# EasyEDA Pro project PCBA_碳化硅3KW图腾柱PFC_2025-04-21.epro, schematic Schematic1_1, sheets 1 to 3 of 6

## Sheets
1 主功率: Board Name: Board1_1; Create Date: 2025-03-01; Page Name: 主功率; Project Name: 碳化硅3KW图腾柱PFC; Schematic Name: Schematic1_1; Update Date: 2025-04-20; Company: 嘉立创EDA; Page Size: A4; Version: V1.0
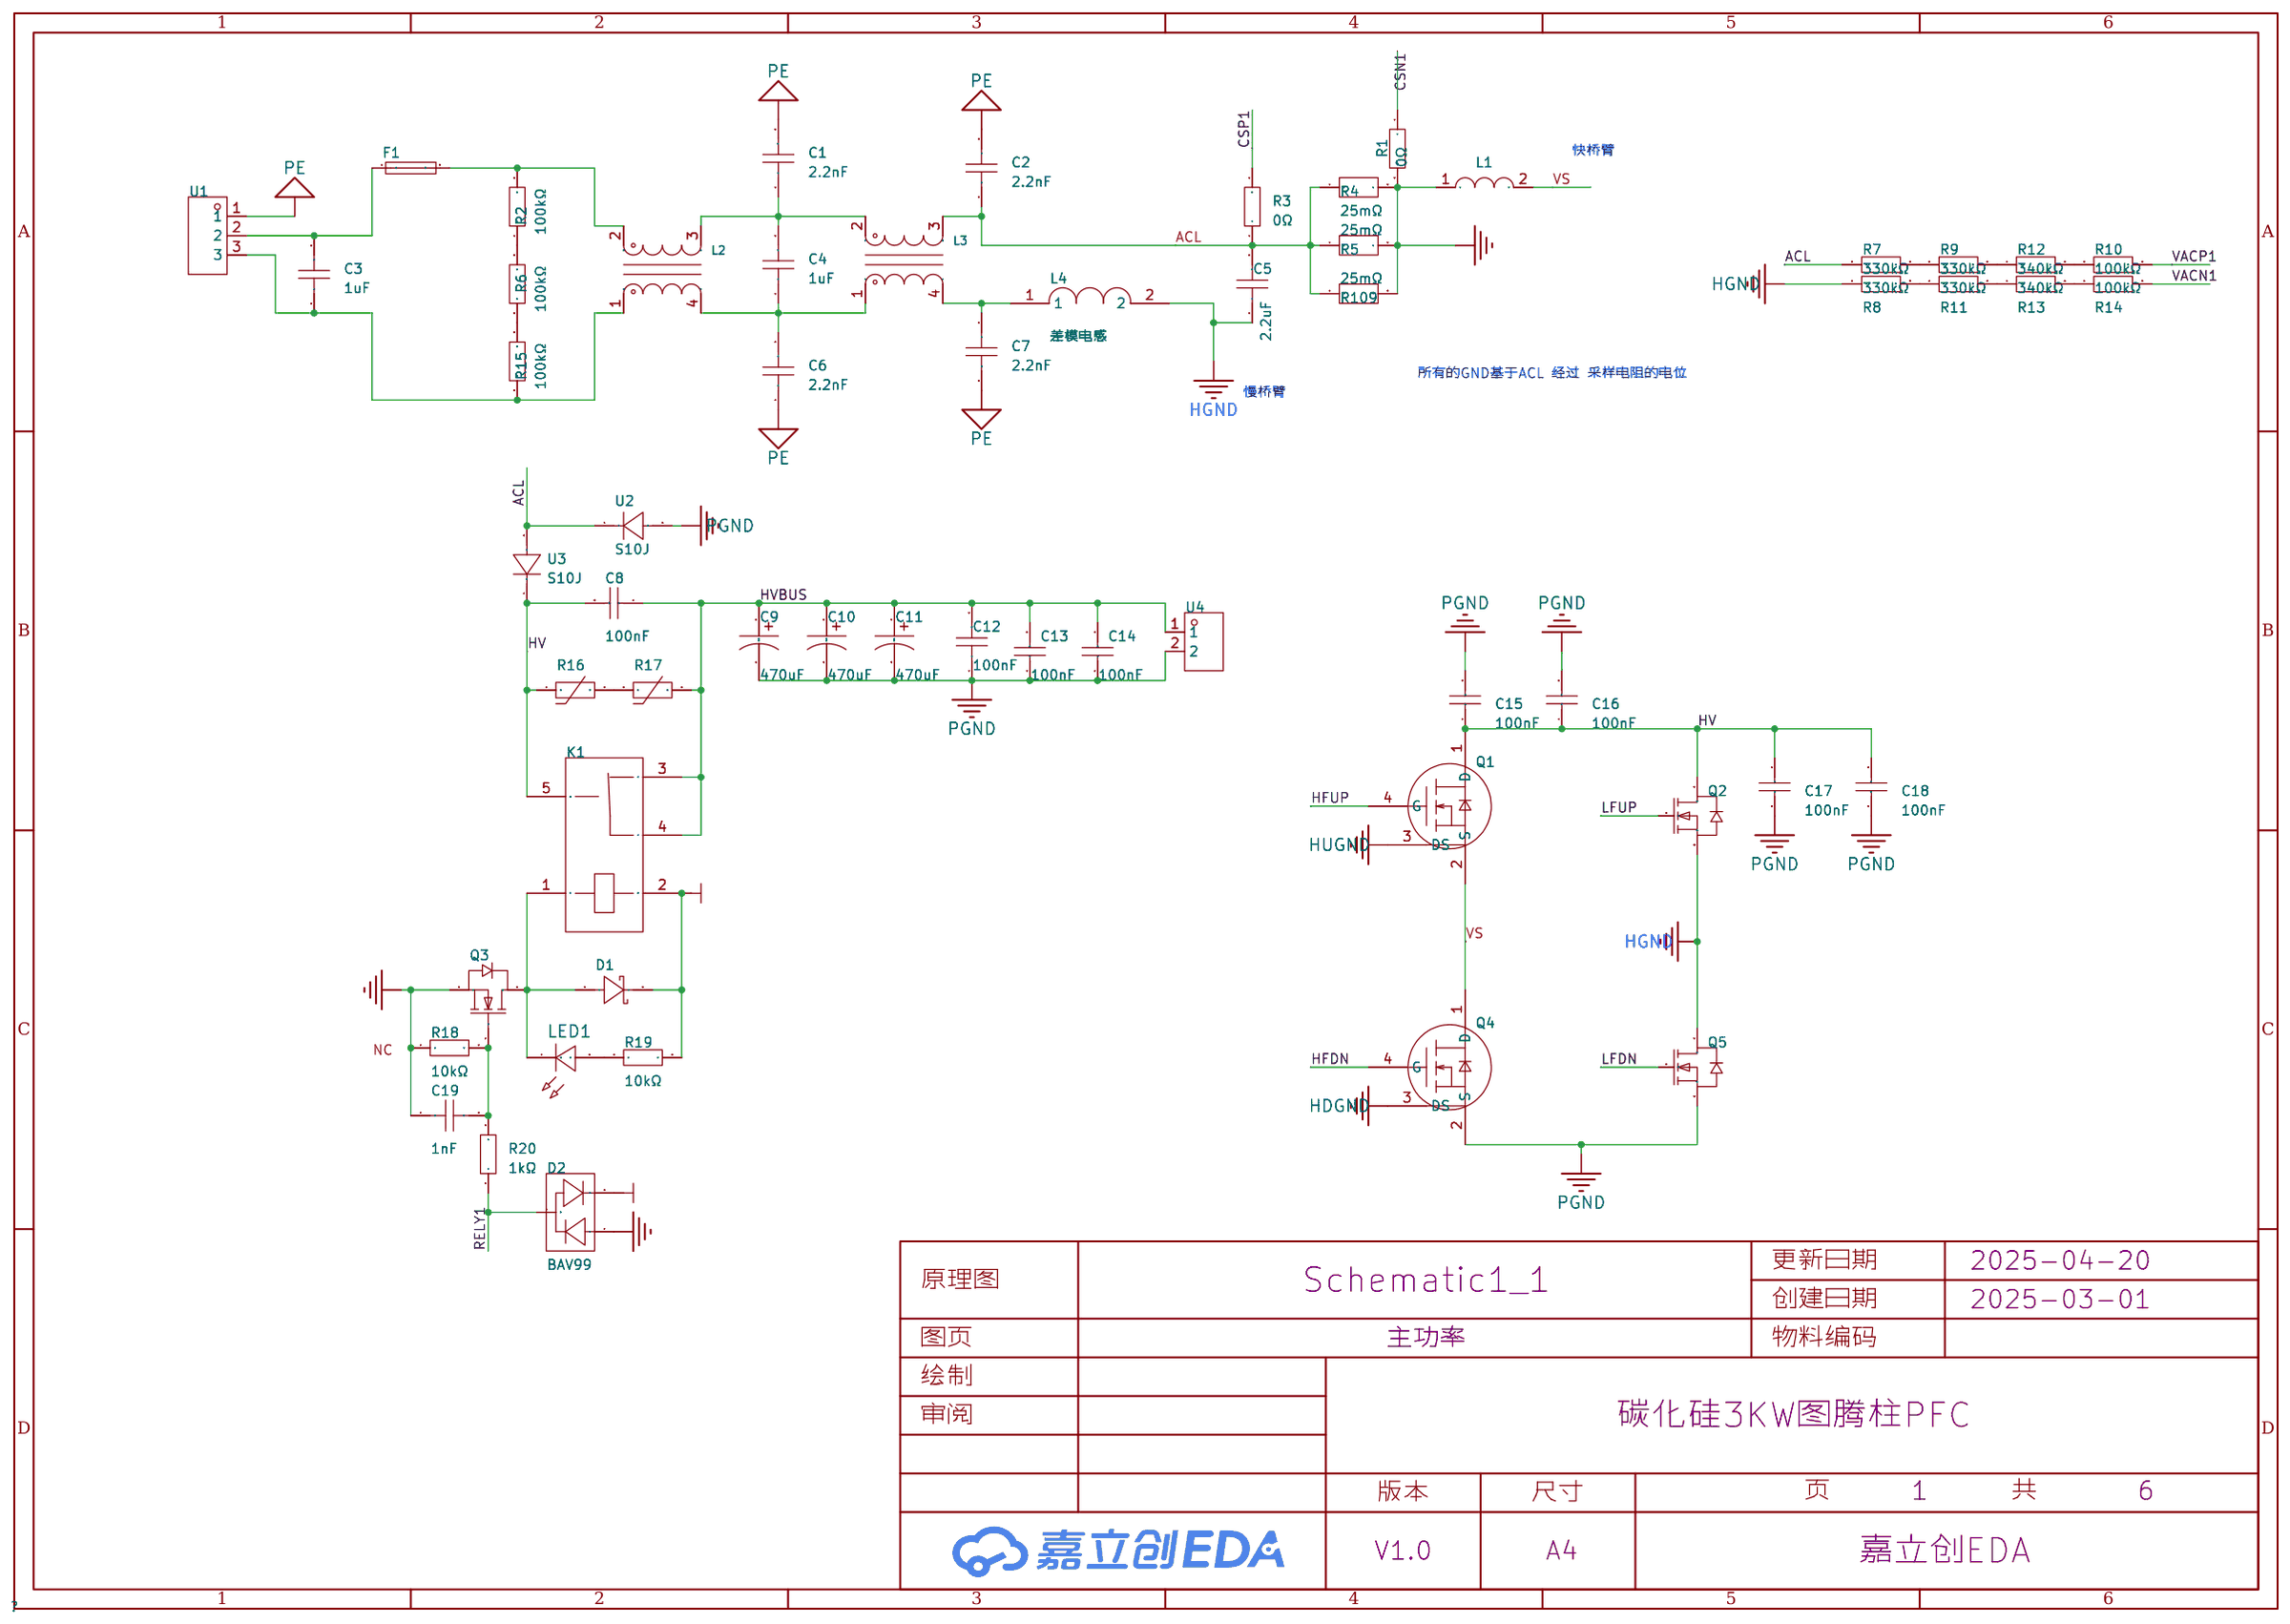
[diagram p0: 主功率]
2 主控: Page Name: 主控; Update Date: 2025-03-01
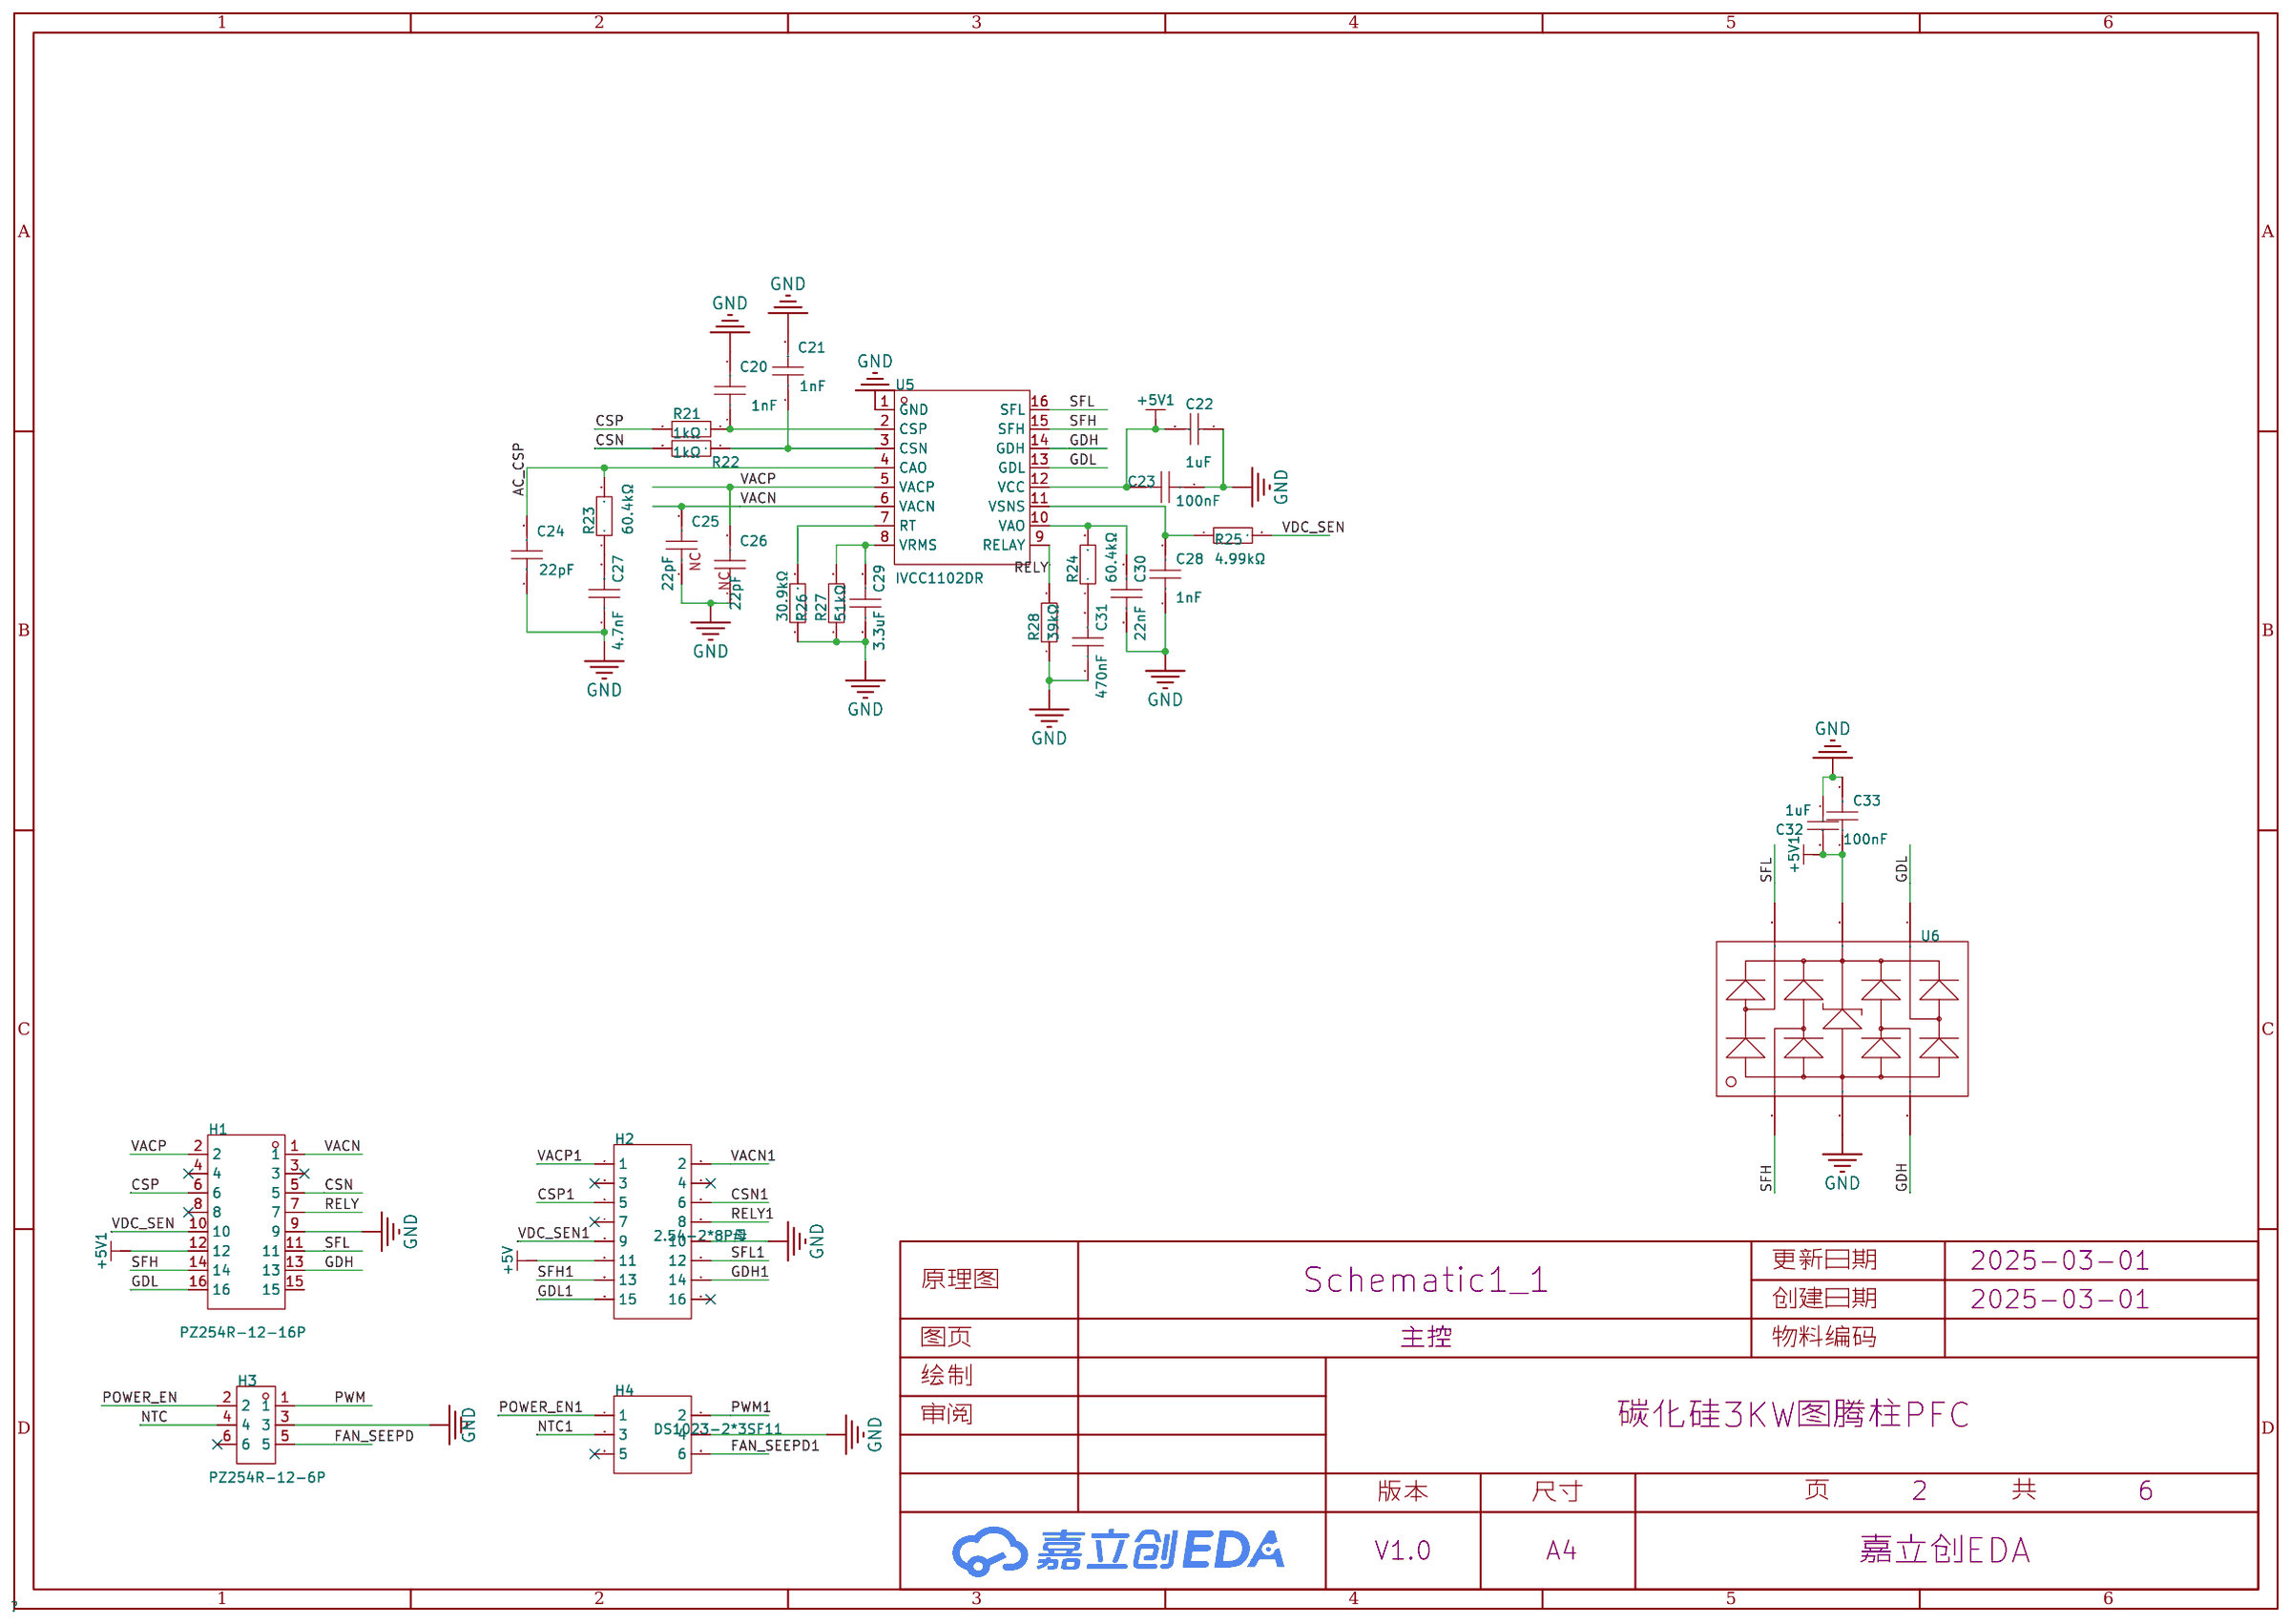
[diagram p1: 主控]
3 辅助供电: Page Name: 辅助供电; Update Date: 2025-03-19
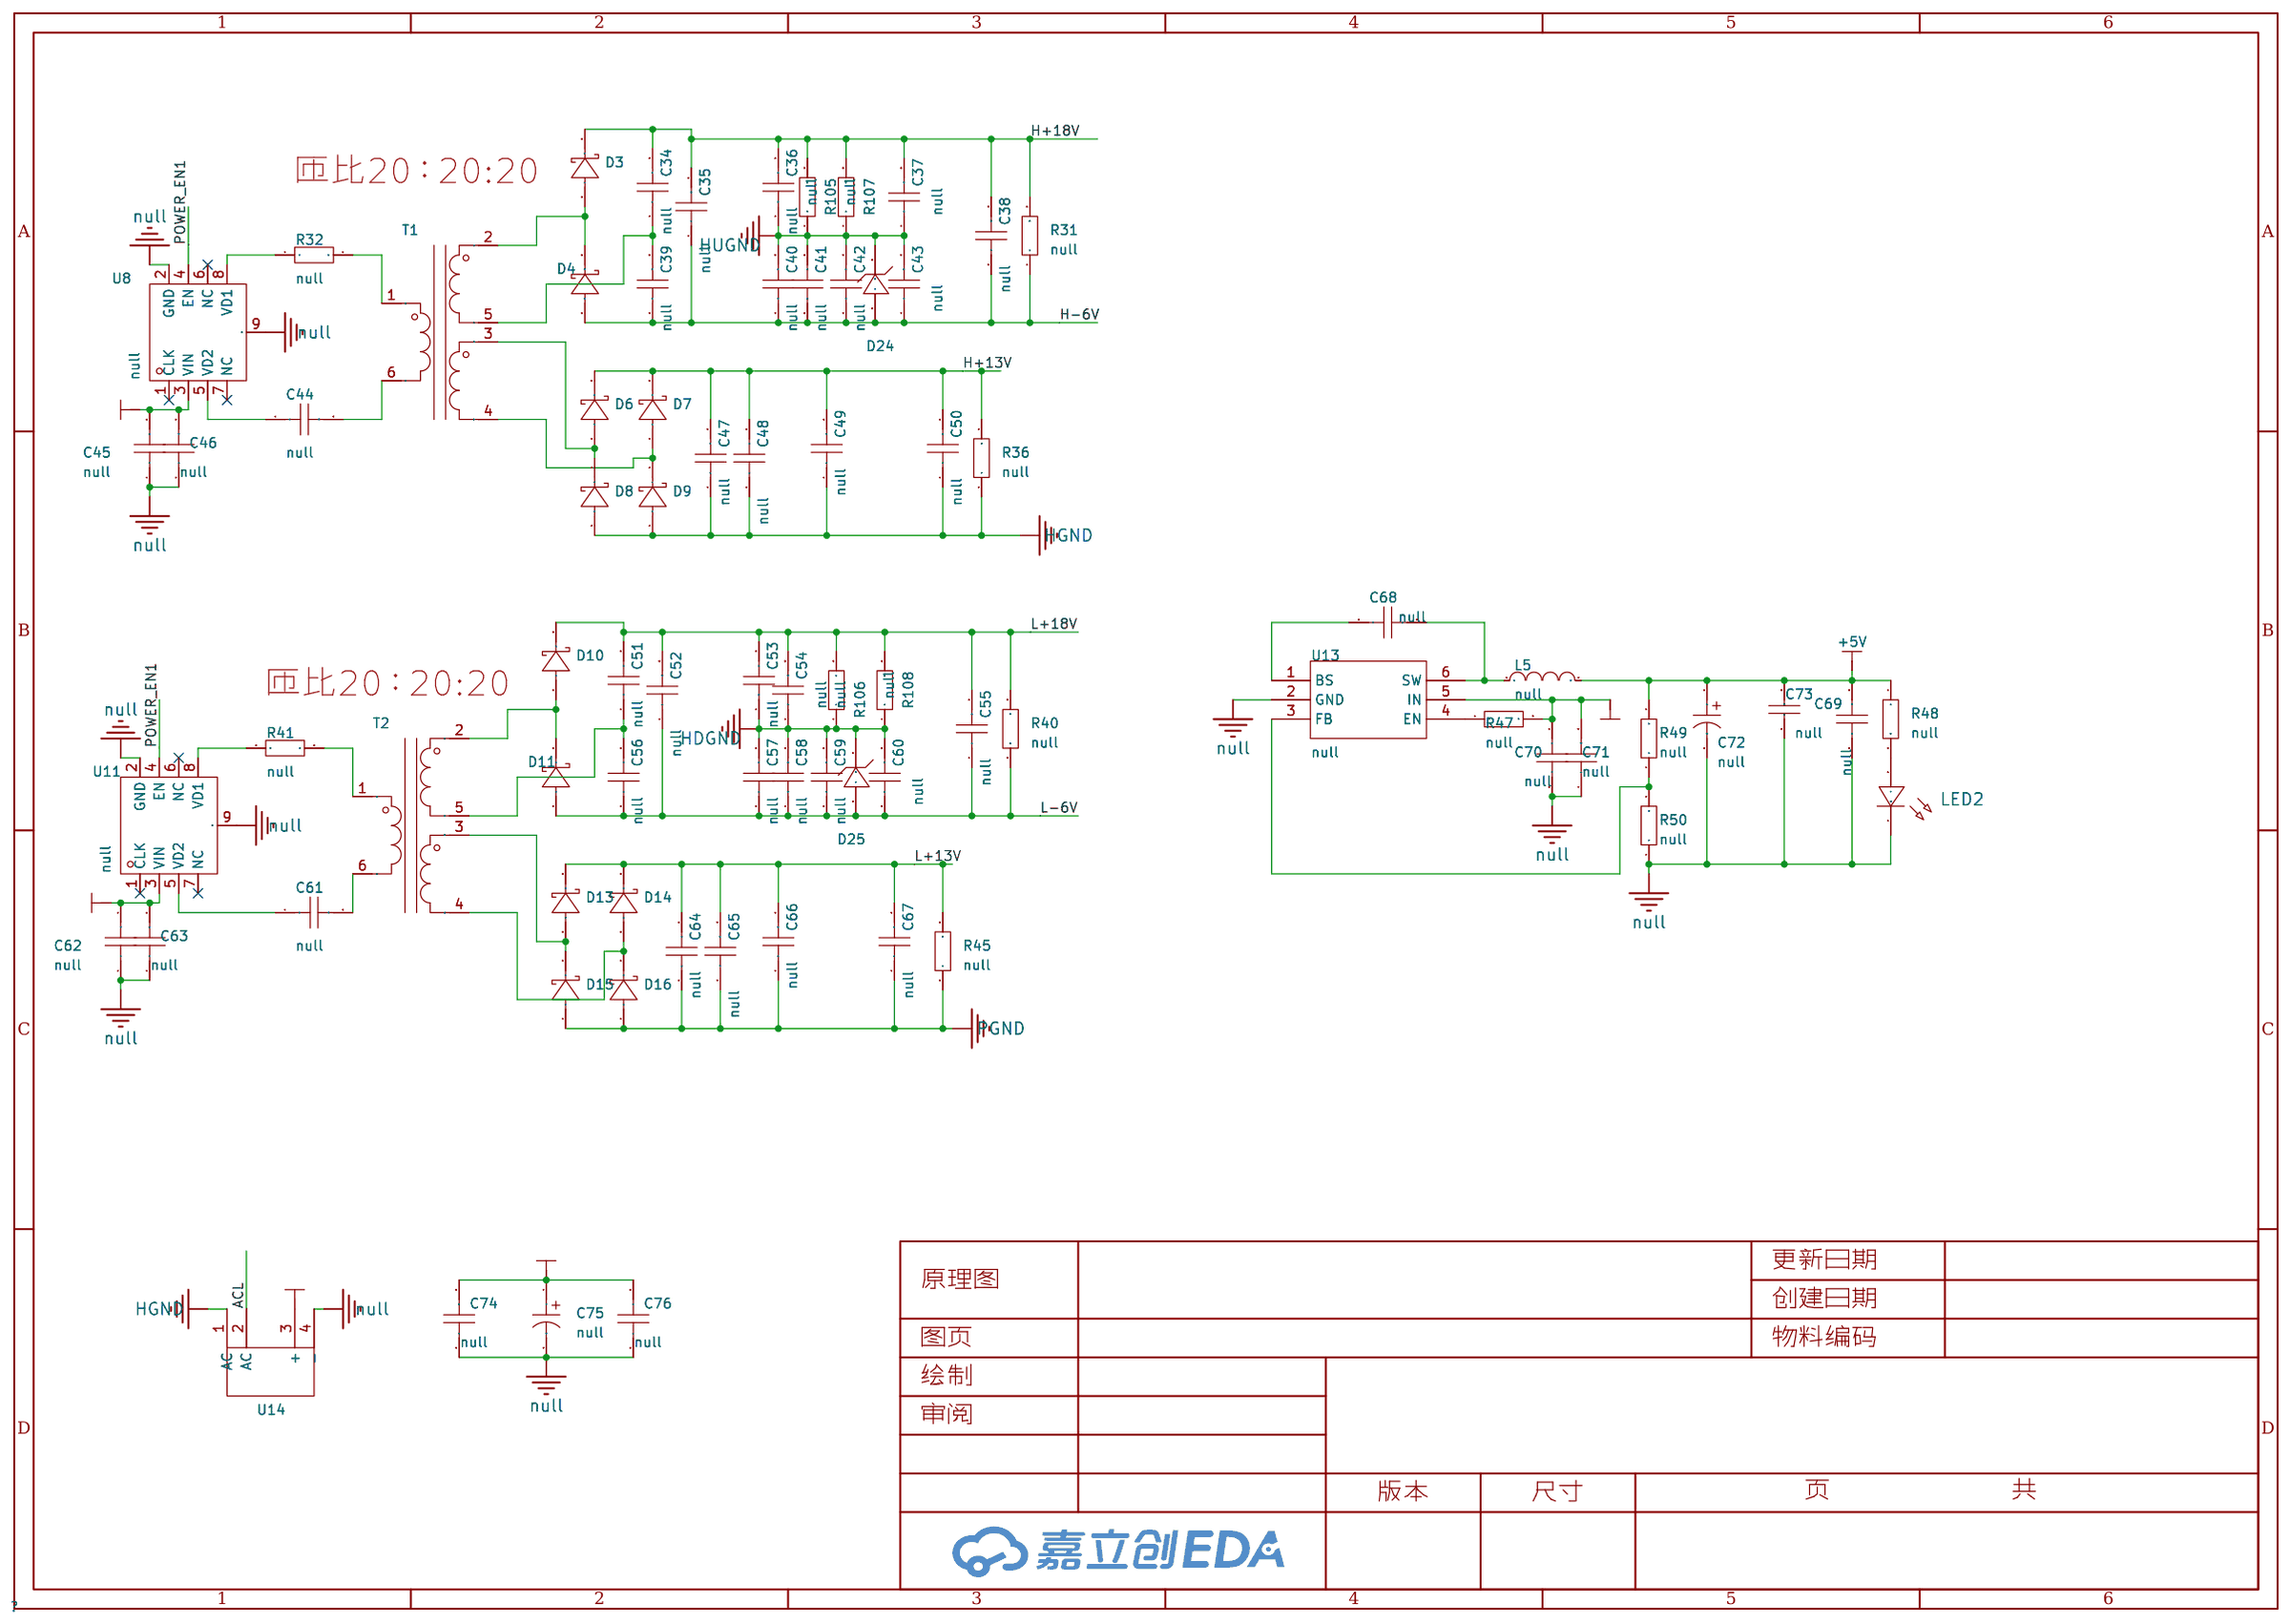
[diagram p2: 辅助供电]

## Parts
sheet 主功率
C1  2.2nF  [CAP-TH_L6.5-W3.5-P7.50-D1.0]
C2  2.2nF  [CAP-TH_L6.5-W3.5-P7.50-D1.0]
C3  1uF  [CONN-TH_L18.0-W9.5_MPX105K31D5KN15800]
C4  1uF  [CONN-TH_L18.0-W9.5_MPX105K31D5KN15800]
C5  2.2uF  [CAP-TH_L22.0-W9.5-P20.00-D0.7]
C6  2.2nF  [CAP-TH_L6.5-W3.5-P7.50-D1.0]
C7  2.2nF  [CAP-TH_L6.5-W3.5-P7.50-D1.0]
C8  100nF  [C1812]
C9  470uF  [CAP-TH_BD35.0-P10.00-D2.3-FD]
C10  470uF  [CAP-TH_BD35.0-P10.00-D2.3-FD]
C11  470uF  [CAP-TH_BD35.0-P10.00-D2.3-FD]
C12  100nF  [CAP-TH_L18.0-W10.0-P15.00-D0.8]
C13  100nF  [C1812]
C14  100nF  [C1812]
C15  100nF  [C1812]
C16  100nF  [C1812]
C17  100nF  [C1812]
C18  100nF  [C1812]
C19  1nF  [C0603]
D1  DSK110  [SOD-123_L2.8-W1.8-LS3.7-FD]
D2  BAV99  [SOT-23-3_L2.9-W1.3-P1.90-LS2.4-BR]
F1  0463020.ER  [FUSE-SMD_L10.1-W3.1]
K1  JQC-3FF/12VDC-1ZS（551)  [RELAY-TH_HF3FF-XX-1ZXX-XXX]
L1  -  [PQ50电感]
L2  FC-HLF2018-5mH-25A-LF  [IND-TH_4P-L22.5-W14.5-P13.00-D1.2-LS10.80]
L3  FC-HLF2018-5mH-25A-LF  [IND-TH_4P-L22.5-W14.5-P13.00-D1.2-LS10.80]
L4  差模电感  [22uH/20A]
LED1  KT-0603R  [LED0603-RD]
Q1  C3M0021120K  [TO-247-4_L15.8-W5.0-P2.54-L]
Q2  IPW60R060P7  [TO-247-3_L15.9-W5.1-P5.44-L]
Q3  2N7002  [SOT-23-3_L2.9-W1.3-P1.90-LS2.4-BR]
Q4  C3M0021120K  [TO-247-4_L15.8-W5.0-P2.54-L]
Q5  IPW60R060P7  [TO-247-3_L15.9-W5.1-P5.44-L]
R1  0Ω  [R0603]
R2  100kΩ  [R1206]
R3  0Ω  [R0603]
R4  25mΩ  [RES-SMD_L6.4-W3.2-R2512]
R5  25mΩ  [RES-SMD_L6.4-W3.2-R2512]
R6  100kΩ  [R1206]
R7  330kΩ  [R1206]
R8  330kΩ  [R1206]
R9  330kΩ  [R1206]
R10  100kΩ  [R1206]
R11  330kΩ  [R1206]
R12  340kΩ  [R1206]
R13  340kΩ  [R1206]
R14  100kΩ  [R1206]
R15  100kΩ  [R1206]
R16  MF72 10D15  [RES-TH_L17.5-W6.0-P7.50-D1.0-S2.00]
R17  MF72 10D15  [RES-TH_L17.5-W6.0-P7.50-D1.0-S2.00]
R18  10kΩ  [R0603]
R19  10kΩ  [R0603]
R20  1kΩ  [R0603]
R109  25mΩ  [RES-SMD_L6.4-W3.2-R2512]
U1  DBT50G-9.5-3P-BK-P OGC  [CONN-TH_3P-P9.50_DBT50G-9.5-3P]
U2  S10J  [SMC_L6.9-W5.9-LS7.9-RD]
U3  S10J  [SMC_L6.9-W5.9-LS7.9-RD]
U4  DBT50G-9.5-2P-BK-P OGC  [CONN-TH_2P-P9.50_DBT50G-9.5-2P]
sheet 主控
C20  1nF  [C0603]
C21  1nF  [C0603]
C22  1uF  [C0603]
C23  100nF  [C0603]
C24  22pF  [C0603]
C25  22pF  [C0603]
C26  22pF  [C0603]
C27  4.7nF  [C0603]
C28  1nF  [C0603]
C29  3.3uF  [C0603]
C30  22nF  [C0603]
C31  470nF  [C0603]
C32  1uF  [C0603]
C33  100nF  [C0603]
H1  PZ254R-12-16P  [HDR-TH_16P-P2.54-H-M-R2-C8-S2.54]
H2  2.54-2*8P母  [HDR-TH_16P-P2.54-V-F-R2-C8-S2.54]
H3  PZ254R-12-6P  [HDR-TH_6P-P2.54-H-M-R2-C3-S2.54]
H4  DS1023-2*3SF11  [HDR-TH_6P-P2.54-V-F-R2-C3-S2.54]
R21  1kΩ  [R0603]
R22  1kΩ  [R0603]
R23  60.4kΩ  [R0603]
R24  60.4kΩ  [R0603]
R25  4.99kΩ  [R0603]
R26  30.9kΩ  [R0603]
R27  51kΩ  [R0603]
R28  39kΩ  [R0603]
U5  IVCC1102DR  [SOIC-16_L9.9-W3.9-P1.27-LS6.0-BL-1]
U6  USBLC6-4SC6  [SOT-23-6_L2.9-W1.6-P0.95-LS2.8-BL]
sheet 辅助供电
C34  4.7uF  [C0805]
C35  100nF  [C0603]
C36  10uF  [C0805]
C37  100nF  [C0603]
C38  10nF  [C0603]
C39  4.7uF  [C0805]
C40  10uF  [C0805]
C41  10uF  [C0805]
C42  10uF  [C0805]
C43  100nF  [C0603]
C44  1uF  [C0603]
C45  1uF  [C0603]
C46  100nF  [C0603]
C47  4.7uF  [C0805]
C48  100nF  [C0603]
C49  10uF  [C0805]
C50  10nF  [C0603]
C51  4.7uF  [C0805]
C52  100nF  [C0603]
C53  10uF  [C0805]
C54  100nF  [C0603]
C55  10nF  [C0603]
C56  4.7uF  [C0805]
C57  10uF  [C0805]
C58  10uF  [C0805]
C59  10uF  [C0805]
C60  100nF  [C0603]
C61  1uF  [C0603]
C62  1uF  [C0603]
C63  100nF  [C0603]
C64  4.7uF  [C0805]
C65  100nF  [C0603]
C66  10uF  [C0805]
C67  10nF  [C0603]
C68  100nF  [C0603]
C69  100nF  [C0603]
C70  1uF  [C0603]
C71  100nF  [C0603]
C72  100uF  [CAP-SMD_BD6.3-L6.6-W6.6-FD]
C73  1uF  [C0603]
C74  100nF  [C0603]
C75  47uF  [CAP-SMD_BD6.3-L6.6-W6.6-LS7.2-FD]
C76  1uF  [C0603]
D3  DSK110  [SOD-123_L2.8-W1.8-LS3.7-FD]
D4  null  [SOD-123_L2.8-W1.8-LS3.7-FD]
D6  DSK110  [SOD-123_L2.8-W1.8-LS3.7-FD]
D7  DSK110  [SOD-123_L2.8-W1.8-LS3.7-FD]
D8  null  [SOD-123_L2.8-W1.8-LS3.7-FD]
D9  DSK110  [SOD-123_L2.8-W1.8-LS3.7-FD]
D10  DSK110  [SOD-123_L2.8-W1.8-LS3.7-FD]
D11  null  [SOD-123_L2.8-W1.8-LS3.7-FD]
D13  DSK110  [SOD-123_L2.8-W1.8-LS3.7-FD]
D14  DSK110  [SOD-123_L2.8-W1.8-LS3.7-FD]
D15  null  [SOD-123_L2.8-W1.8-LS3.7-FD]
D16  DSK110  [SOD-123_L2.8-W1.8-LS3.7-FD]
D24  null  [SMA_L4.4-W2.6-LS5.0-RD]
D25  null  [SMA_L4.4-W2.6-LS5.0-RD]
L5  10uH  [IND-SMD_L4.4-W4.2]
LED2  KT-0603R  [LED0603-RD]
R31  10kΩ  [R0603]
R32  1Ω  [R1206]
R36  10kΩ  [R0603]
R40  10kΩ  [R0603]
R41  1Ω  [R1206]
R45  10kΩ  [R0603]
R47  10kΩ  [R0603]
R48  4.7kΩ  [R0603]
R49  24kΩ  [R0603]
R50  3.3kΩ  [R0603]
R105  4.7K  [R0805]
R106  4.7K  [R0805]
R107  4.7K  [R0805]
R108  4.7K  [R0805]
T1  -  [TR1495_10_20_20]
T2  -  [TR1495_10_20_20]
U8  null  [ESOP-8_L4.9-W3.9-P1.27-LS6.0-BL-EP-4]
U11  null  [ESOP-8_L4.9-W3.9-P1.27-LS6.0-BL-EP-4]
U13  null  [SOT-23-6_L2.9-W1.6-P0.95-LS2.8-BL]
U14  -  [DC-AUX-12V]

## Library data of the parts
C1 C2 C6 C7 = KJKF222M2FF7035A075E: 容值:2.2nF;精度:±20%;电压(AC):300V;等级:Y2;; LCSC Part Name: 2.2nF ±20% 300V 等级:Y2; Supplier Part: C2803195; Manufacturer: KNSCHA(科尼盛); Supplier Footprint: 插件,P=7.5mm; JLCPCB Part Class: 扩展库; Datasheet: https://atta.szlcsc.com/upload/public/pdf/source/20210420/C2803195_BA0DBC8778A43A5602C5594119034AD5.pdf; Supplier: LCSC; Tolerance: ±20%; Voltage(AC): 300V; Subclass: Y2; safety certification: UL；ENEC；VDE；CQC
C3 C4 = MPX105K31D5KN15800: 容值:1uF;精度:±10%;电压(AC):275V；310V；305V;等级:X2;; LCSC Part Name: 1uF ±10% 275V 305V 310V 等级:X2; Supplier Part: C504224; Manufacturer: KNSCHA(科尼盛); Supplier Footprint: 插件,P=15mm; JLCPCB Part Class: 扩展库; Datasheet: https://atta.szlcsc.com/upload/public/pdf/source/20200409/C504224_1CACC68A7F476E46F1FE2B8F2B31D5D4.pdf; Supplier: LCSC; Tolerance: ±10%; Voltage(AC): 275V；310V；305V; Subclass: X2; safety certification: UL；CUL；KC；ENEC；VDE；CQC; Operating Temperature: -40℃~+110℃
C5 = CBB21-400V225JP20: 容值:2.2uF;精度:±5%;额定电压:400V;工作温度:-40℃~+105℃;; LCSC Part Name: 2.2uF ±5% 400V; Supplier Part: C2888197; Manufacturer: 东通电子; Supplier Footprint: 插件,P=20mm; JLCPCB Part Class: 扩展库; Datasheet: https://atta.szlcsc.com/upload/public/pdf/source/20210928/C2888197_9B799BC52F6AC21AB1FBBD07FC56CD82.pdf; Supplier: LCSC; Tolerance: ±5%; Voltage Rated: 400V; Operating Temperature: -40℃~+105℃
C8 C13-C18 = C1812X104K102T: 容值:100nF;精度:±10%;额定电压:1kV;材质(温度系数):X7R;; LCSC Part Name: 100nF ±10% 1kV; Supplier Part: C106147; Manufacturer: IHHEC(禾伸堂); Supplier Footprint: 1812; JLCPCB Part Class: 扩展库; Datasheet: https://atta.szlcsc.com/upload/public/pdf/source/20200107/C480252_7555B8030C78C61255815F1A361BC317.pdf; Supplier: LCSC; Tolerance: ±10%; Voltage Rated: 1kV; Temperature Coefficient: X7R
C9-C11 = ST-50470UF450V01EC4326: 容值:470uF;额定电压:450V;脚间距:-;等效串联电阻:-;纹波电流:-;; LCSC Part Name: 470uF 450V; Supplier Part: C2992585; Manufacturer: KNSCHA(科尼盛); Supplier Footprint: 插件,D35xL40mm; JLCPCB Part Class: 扩展库; Datasheet: https://atta.szlcsc.com/upload/public/pdf/source/20220414/2246BE5B19AEC50306F31C43D12EB62F.pdf; Supplier: LCSC; Rated Voltage: 450V
C12 = MMK104J2JDLAJ208G0: 容值:100nF;精度:±5%;额定电压:630V;工作温度:-40℃~+105℃;; LCSC Part Name: 100nF ±5% 630V; Supplier Part: C2915665; Manufacturer: KNSCHA(科尼盛); Supplier Footprint: 插件,P=15mm; JLCPCB Part Class: 扩展库; Datasheet: https://atta.szlcsc.com/upload/public/pdf/source/20211112/CC86AA9AD574EABEC012E427942A9F20.pdf; Supplier: LCSC; Tolerance: ±5%; Voltage Rated: 630V; Operating Temperature: -40℃~+105℃
C19-C21 C28 = CL10B102KB8NNNC: 容值:1nF;精度:±10%;额定电压:50V;材质(温度系数):X7R;; LCSC Part Name: 1nF ±10% 50V; Supplier Part: C1588; Manufacturer: SAMSUNG(三星); Supplier Footprint: 0603; JLCPCB Part Class: Basic Part; Datasheet: https://atta.szlcsc.com/upload/public/pdf/source/20160218/1457707763339.pdf; Supplier: LCSC; Tolerance: ±10%; Voltage Rated: 50V; Temperature Coefficient: X7R
D1 D3 D6 D7 D9 D10 D13 D14 D16 = DSK110_C908227: 二极管配置:-;正向压降(Vf):850mV@1A;直流反向耐压(Vr):100V;平均整流电流(Io):1A;; LCSC Part Name: 电压:100V 电流:1A; Supplier Part: C908227; Manufacturer: FUXINSEMI(富芯森美); Supplier Footprint: SOD-123; JLCPCB Part Class: 扩展库; Datasheet: https://atta.szlcsc.com/upload/public/pdf/source/20201027/C908227_56774C7FA3F54032F9E299E0F5E1A587.pdf; Supplier: LCSC; Forward Voltage (Vf@If): 850mV@1A; Reverse Voltage (Vr): 100V; Average Rectified Current (Io): 1A; Reverse Leakage Current (Ir): 500nA
D2 = BAV99_C916421: 二极管配置:1对串联式;正向压降(Vf):1.25V@150mA;直流反向耐压(Vr):75V;平均整流电流(Io):215mA;功率:350mW;反向恢复时间(trr):4ns;; LCSC Part Name: 电压:75V 电流:215mA; Supplier Part: C916421; Manufacturer: JSMSEMI(杰盛微); Supplier Footprint: SOT-23; JLCPCB Part Class: 扩展库; Datasheet: https://atta.szlcsc.com/upload/public/pdf/source/20230807/11783D3585FB2C3082AA42FFBDFBC934.pdf; Supplier: LCSC; Diode Configuration: 1对串联式; Forward Voltage (Vf@If): 1.25V@150mA; Reverse Voltage (Vr): 75V; Average Rectified Current (Io): 215mA; Power Dissipation: 350mW; Reverse Leakage Current: 1uA@75V; Reverse Recovery Time (trr): 4ns
F1 = 0463020.ER: 类型:贴片式保险丝;额定电流:20A;额定电压 (AC):250V;分断能力:50A；100A;; LCSC Part Name: 250V贴片式保险丝; Supplier Part: C187581; Manufacturer: Littelfuse(美国力特); Supplier Footprint: SMD,10.1x3.1mm; JLCPCB Part Class: 扩展库; Datasheet: https://atta.szlcsc.com/upload/public/pdf/source/20180709/C187581_00E8FABFF3CF2DC8CD9A5381530BF9F6.pdf; Supplier: LCSC; Type: 贴片式保险丝; Current Rating: 20A; Voltage Rating  (AC): 250V; Operating Temperature: -55℃~+125℃; Breaking Capacity: 50A；100A
K1 = JQC-3FF/12VDC-1ZS（551): 线圈电压:12V;触点形式:一组转换:1C(单刀双掷-转换);触点容量(电阻负载):10A@28VDC；10A@277VAC;最大切换电压:277V@AC；30V@DC;最大切换电流:10A;; LCSC Part Name: 超小型大功率12V继电器 单刀双掷; Supplier Part: C46485; Manufacturer: HF(宏发); Supplier Footprint: 插件,15.5x19mm; JLCPCB Part Class: 扩展库; Datasheet: https://atta.szlcsc.com/upload/public/pdf/source/20180716/C46485_585E79CF8776BCCA045310780B202E73.pdf; Supplier: LCSC; Coil Voltage: 12V; Contact Form: 一组转换:1C(单刀双掷-转换); Pin Number: 5; Contact Rating: 10A@28VDC；10A@277VAC; Maximum Switching Voltage: 277V@AC；30V@DC; Coil Rated Power: 360mW; Contact Material: AgCdO; Maximum Switching Current: 10A; Coil Type: 无极性-单线圈; Coil Resistance: 400Ω; Contact Resistance: 100mΩ; Operate Time: 10ms; Release Time: 5ms; Operating Temperature: -40℃~+85℃
L1 = PQ59电感: Check: false
L2 L3 = FC-HLF2018-5mH-25A-LF: 线路数:-;电感 @ 频率:5mH;阻抗 @ 频率:-;直流电阻(DCR):6.5mΩ;; LCSC Part Name: 插件共模滤波器; Supplier Part: C5307518; Manufacturer: FC(方成); Supplier Footprint: 插件; JLCPCB Part Class: 扩展库; Datasheet: https://atta.szlcsc.com/upload/public/pdf/source/20221207/3992F2C35BDE318E91CE6ED02A57E846.pdf; Supplier: LCSC; Current Rating: 25A; Inductance @ Frequency: 5mH; DC Resistance (DCR): 6.5mΩ; Operating Temperature: -40℃~+125℃
L4 = 22uh/20A电感: Check: false
LED1 LED2 = KT-0603R: 发光颜色:红色;功率:-;正向电流:-;主波长:-;二极管配置:-;透镜颜色:-;色温:-;发光角度:-;载带方式:-;工作温度:-40℃~+85℃;; LCSC Part Name: 0603 红灯 高亮; Supplier Part: C2286; Manufacturer: KENTO; Supplier Footprint: 0603; JLCPCB Part Class: Basic Part; Datasheet: https://atta.szlcsc.com/upload/public/pdf/source/20160616/1466072038404.pdf; Supplier: LCSC; Emitted Color: 红色; Operating Temperature: -40℃~+85℃
Q1 Q4 = C3M0021120K: Supplier Part: C5713521; Manufacturer: Wolfspeed; Supplier Footprint: TO-247-4; Datasheet: https://atta.szlcsc.com/upload/public/pdf/source/20230504/5EB95768776780E8B4524F5A91D3627E.pdf; Supplier: LCSC
Q2 Q5 = IPW60R060P7: 类型:1个N沟道;漏源电压(Vdss):600V;连续漏极电流(Id):48A;功率(Pd):164W;导通电阻(RDS(on)@Vgs,Id):60mΩ@10V,15.9A;阈值电压(Vgs(th)@Id):4V@800uA;; LCSC Part Name: 1个N沟道 耐压:600V 电流:48A; Supplier Part: C454258; Manufacturer: Infineon(英飞凌); Supplier Footprint: TO-247-3; JLCPCB Part Class: 扩展库; Datasheet: https://atta.szlcsc.com/upload/public/pdf/source/20191206/C467013_B44523BA8C7316C654823927CDC04994.pdf; Supplier: LCSC; Type: 1个N沟道; Drain Source Voltage (Vdss): 600V; Continuous Drain Current (Id): 48A; Power Dissipation (Pd): 164W; Drain Source On Resistance (RDS(on)@Vgs,Id): 60mΩ@10V,15.9A; Gate Threshold Voltage (Vgs(th)@Id): 4V@800uA
Q3 = 2N7002_C8545: 类型:N沟道;漏源电压(Vdss):60V;连续漏极电流(Id):115mA;功率(Pd):200mW;导通电阻(RDS(on)@Vgs,Id):7.5Ω@10V,500mA;阈值电压(Vgs(th)@Id):2.5V@250uA;; LCSC Part Name: N沟道 耐压:60V 电流:115mA; Supplier Part: C8545; Manufacturer: CJ(江苏长电/长晶); Supplier Footprint: SOT-23; JLCPCB Part Class: 基础库; Datasheet: https://atta.szlcsc.com/upload/public/pdf/source/20171228/C164913_15144413269051213916.pdf; Supplier: LCSC; Type: N沟道; Drain Source Voltage (Vdss): 60V; Continuous Drain Current (Id): 115mA; Power Dissipation (Pd): 200mW; Drain Source On Resistance (RDS(on)@Vgs,Id): 7.5Ω@10V,500mA; Gate Threshold Voltage (Vgs(th)@Id): 2.5V@250uA
R1 R3 = 0603WAF0000T5E: 电阻类型:厚膜电阻;阻值:0Ω;精度:±1%;功率:100mW;最大工作电压:75V;; LCSC Part Name: 0Ω ±1% 100mW 厚膜电阻; Supplier Part: C21189; Manufacturer: UNI-ROYAL(厚声); Supplier Footprint: 0603; JLCPCB Part Class: Basic Part; Datasheet: https://atta.szlcsc.com/upload/public/pdf/source/20200306/C422600_1E6D84923E4A46A82E41ADD87F860B5C.pdf; Supplier: LCSC; Type: 厚膜电阻; Tolerance: ±1%; Power(Watts): 100mW; Overload Voltage (Max): 75V; Operating Temperature Range: -55℃~+155℃
R2 R6 R10 R14 R15 = 1206W4F1003T5E: 电阻类型:厚膜电阻;阻值:100kΩ;精度:±1%;功率:250mW;最大工作电压:200V;温度系数:±100ppm/℃;; LCSC Part Name: 100kΩ ±1% 250mW 厚膜电阻; Supplier Part: C17900; Manufacturer: UNI-ROYAL(厚声); Supplier Footprint: 1206; JLCPCB Part Class: Basic Part; Datasheet: https://atta.szlcsc.com/upload/public/pdf/source/20200306/C422600_1E6D84923E4A46A82E41ADD87F860B5C.pdf; Supplier: LCSC; Type: 厚膜电阻; Tolerance: ±1%; Power(Watts): 250mW; Overload Voltage (Max): 200V; Temperature Coefficient: ±100ppm/℃; Operating Temperature Range: -55℃~+155℃
R4 R5 R109 = PA2512FKF7T0R02E: 阻值:20mΩ;精度:±1%;功率:3W;温度系数:±100ppm/℃;; LCSC Part Name: 20mΩ ±1% 3W; Supplier Part: C728331; Manufacturer: YAGEO(国巨); Supplier Footprint: 2512; JLCPCB Part Class: 扩展库; Datasheet: https://atta.szlcsc.com/upload/public/pdf/source/20200824/C728331_C873F7470E5458A0F083BEB6B1EBF0B4.pdf; Supplier: LCSC; Tolerance: ±1%; Power(Watts): 3W; Temperature Coefficient: ±100ppm/℃
R7-R9 R11 = 1206W4F3303T5E: 电阻类型:厚膜电阻;阻值:330kΩ;精度:±1%;功率:250mW;最大工作电压:200V;温度系数:±100ppm/℃;; LCSC Part Name: 330kΩ ±1% 250mW 厚膜电阻; Supplier Part: C17929; Manufacturer: UNI-ROYAL(厚声); Supplier Footprint: 1206; JLCPCB Part Class: Extended Part; Datasheet: https://atta.szlcsc.com/upload/public/pdf/source/20200306/C422600_1E6D84923E4A46A82E41ADD87F860B5C.pdf; Supplier: LCSC; Type: 厚膜电阻; Tolerance: ±1%; Power(Watts): 250mW; Overload Voltage (Max): 200V; Temperature Coefficient: ±100ppm/℃; Operating Temperature Range: -55℃~+155℃
R12 R13 = RS-06K3403FT: 电阻类型:厚膜电阻;阻值:340kΩ;精度:±1%;功率:250mW;最大工作电压:200V;温度系数:±100ppm/℃;; LCSC Part Name: 厚膜电阻 340kΩ ±1% 250mW; Supplier Part: C310348; Manufacturer: FH(风华); Supplier Footprint: 1206; JLCPCB Part Class: Extended Part; Datasheet: https://atta.szlcsc.com/upload/public/pdf/source/20140616/1457707091974.pdf; Supplier: LCSC; Type: 厚膜电阻; Tolerance: ±1%; Power(Watts): 250mW; Overload Voltage (Max): 200V; Temperature Coefficient: ±100ppm/℃; Operating Temperature Range: -55℃~+155℃
R16 R17 = MF72 10D15: 阻值(25℃):10Ω;B值(25℃/50℃):3200K;电阻精度:±20%;功率:5W;B值精度:±10%;最大稳态电流(25℃):5A;; LCSC Part Name: 10Ω 电阻精度:±20% 3200K; Supplier Part: C122778; Manufacturer: 时恒; Supplier Footprint: 插件,P=7.5mm; JLCPCB Part Class: 扩展库; Datasheet: https://atta.szlcsc.com/upload/public/pdf/source/20170721/C122778_1500627496269835254.pdf; Supplier: LCSC; Resistance @ 25℃: 10Ω; B Constant (25℃/50℃): 3200K; Resistance Tolerance: ±20%; Power: 5W; B Constant Tolerance: ±10%; Steady State Current (Max): 5A; Operating Temperature: -40℃~+200℃
R18 R19 R31 R36 R40 R45 R47 R49 = 0603WAF1002T5E: 电阻类型:厚膜电阻;阻值:10kΩ;精度:±1%;功率:100mW;最大工作电压:75V;温度系数:±100ppm/℃;; LCSC Part Name: 厚膜电阻 10kΩ ±1% 100mW; Supplier Part: C25804; Manufacturer: UNI-ROYAL(厚声); Supplier Footprint: 0603; JLCPCB Part Class: Basic Part; Datasheet: https://atta.szlcsc.com/upload/public/pdf/source/20200306/C422600_1E6D84923E4A46A82E41ADD87F860B5C.pdf; Supplier: LCSC; Type: 厚膜电阻; Tolerance: ±1%; Power(Watts): 100mW; Overload Voltage (Max): 75V; Temperature Coefficient: ±100ppm/℃; Operating Temperature Range: -55℃~+155℃
R20-R22 = 0603WAF1001T5E: 电阻类型:厚膜电阻;阻值:1kΩ;精度:±1%;功率:100mW;最大工作电压:75V;温度系数:±100ppm/℃;; LCSC Part Name: 1kΩ ±1% 100mW 厚膜电阻; Supplier Part: C21190; Manufacturer: UNI-ROYAL(厚声); Supplier Footprint: 0603; JLCPCB Part Class: Basic Part; Datasheet: https://atta.szlcsc.com/upload/public/pdf/source/20200306/C422600_1E6D84923E4A46A82E41ADD87F860B5C.pdf; Supplier: LCSC; Type: 厚膜电阻; Tolerance: ±1%; Power(Watts): 100mW; Overload Voltage (Max): 75V; Temperature Coefficient: ±100ppm/℃; Operating Temperature Range: -55℃~+155℃
U1 = DBT50G-9.5-3P: 隔板类型:带盖板;间距:9.5mm;结构:1x3P;安装方式:直针;引脚位置:边脚;排数:1;额定电流:32A;额定电压:750V;线规 - AWG:12~22;线规 - 平方毫米:4;工作温度范围:-40℃~+105℃;颜色:黑色;每排PIN数:3;; LCSC Part Name: 9.5mm 1x3P 每排P数:3 排数:1 直针 边脚; Supplier Part: C395959; Manufacturer: DORABO(地博电气); Supplier Footprint: 插件,P=9.5mm; JLCPCB Part Class: Extended Part; Datasheet: https://atta.szlcsc.com/upload/public/pdf/source/20221019/84C53DE9D8912EDE417B2211EE296996.pdf; Supplier: LCSC; Barrier Type: 带盖板; Pitch: 9.5mm; Structure: 1x3P; Mounting Style: 直针; Pin Location: 边脚; Number of Pins: 3P; Number of Rows: 1; Current Rating (Max): 32A; Voltage Rating (Max): 750V; Wire Gauge - AWG: 12~22; Wire Gauge - mm2: 4; Operating Temperature Range: -40℃~+105℃; Color: 黑色; Number of PINs Per Row: 3
U2 U3 = S10J: 正向压降(Vf):1V@10A;直流反向耐压(Vr):600V;平均整流电流(Io):10A;; LCSC Part Name: 电压:600V 电流:10A; Supplier Part: C5292848; Manufacturer: CJ(江苏长电/长晶); Supplier Footprint: SMCG; Datasheet: https://atta.szlcsc.com/upload/public/pdf/source/20221215/30B6106E9DF49259FEAC85787638B431.pdf; Supplier: LCSC; Forward Voltage (Vf@If): 1V@10A; Reverse Voltage (Vr): 600V; Average Rectified Current (Io): 10A; Reverse Leakage Current: 5uA@600V
U4 = DBT50G-9.5-2P: 隔板类型:带盖板;间距:9.5mm;结构:1x2P;安装方式:直针;引脚位置:边脚;排数:1;额定电流:32A;额定电压:750V;线规 - AWG:12~22;线规 - 平方毫米:4;工作温度范围:-40℃~+105℃;颜色:黑色;每排PIN数:2;; LCSC Part Name: 9.5mm 1x2P 每排P数:2 排数:1 直针 边脚; Supplier Part: C395958; Manufacturer: DORABO(地博电气); Supplier Footprint: 插件,P=9.5mm; JLCPCB Part Class: Extended Part; Datasheet: https://atta.szlcsc.com/upload/public/pdf/source/20230619/13ADDB604F78DE06B1EFD4F82CE20A46.pdf; Supplier: LCSC; Barrier Type: 带盖板; Pitch: 9.5mm; Structure: 1x2P; Mounting Style: 直针; Pin Location: 边脚; Number of Pins: 2P; Number of Rows: 1; Current Rating (Max): 32A; Voltage Rating (Max): 750V; Wire Gauge - AWG: 12~22; Wire Gauge - mm2: 4; Operating Temperature Range: -40℃~+105℃; Color: 黑色; Number of PINs Per Row: 2
C22 C32 C73 = 0603B105K250NT: 容值:1uF;精度:±10%;额定电压:25V;材质(温度系数):X7R;; Supplier: LCSC; Manufacturer: FH(风华); Supplier Part: C59302; JLCPCB Part Class: 扩展库; LCSC Part Name: 1uF ±10% 25V; Supplier Footprint: 0603; Datasheet: https://atta.szlcsc.com/upload/public/pdf/source/20200305/C486355_26A10D38EF8C2A5C37091D0039909270.pdf; Tolerance: ±10%; Voltage Rated: 25V; Temperature Coefficient: X7R
C23 C33 C35 C37 C43 C46 C48 C52 C54 C60 C63 C65 C69 C71 C74 = CC0603KRX7R9BB104: 容值:100nF;精度:±10%;额定电压:50V;材质(温度系数):X7R;; LCSC Part Name: 100nF ±10% 50V; Supplier Part: C14663; Manufacturer: YAGEO(国巨); Supplier Footprint: 0603; JLCPCB Part Class: Basic Part; Datasheet: https://atta.szlcsc.com/upload/public/pdf/source/20180910/C282072_33301C7F631E79921B82A8DAC6BCC5B3.pdf; Supplier: LCSC; Tolerance: ±10%; Voltage Rated: 50V; Temperature Coefficient: X7R
C24-C26 = CL10C220JB8NNNC: 容值:22pF;精度:±5%;额定电压:50V;材质(温度系数):C0G;; LCSC Part Name: 22pF ±5% 50V; Supplier Part: C1653; Manufacturer: SAMSUNG(三星); Supplier Footprint: 0603; JLCPCB Part Class: Basic Part; Datasheet: https://atta.szlcsc.com/upload/public/pdf/source/20160218/1457707763339.pdf; Supplier: LCSC; Tolerance: ±5%; Voltage Rated: 50V; Temperature Coefficient: C0G
C27 = 0603B472K500NT: 容值:4.7nF;精度:±10%;额定电压:50V;材质(温度系数):X7R;; LCSC Part Name: 4.7nF ±10% 50V; Supplier Part: C53987; Manufacturer: FH(风华); Supplier Footprint: 0603; JLCPCB Part Class: Basic Part; Datasheet: https://atta.szlcsc.com/upload/public/pdf/source/20200305/C486355_26A10D38EF8C2A5C37091D0039909270.pdf; Supplier: LCSC; Tolerance: ±10%; Voltage Rated: 50V; Temperature Coefficient: X7R
C29 = CL10A335KP8NNNC: 容值:3.3uF;精度:±10%;额定电压:10V;材质(温度系数):X5R;; LCSC Part Name: 3.3uF ±10% 10V; Supplier Part: C51412; Manufacturer: SAMSUNG(三星); Supplier Footprint: 0603; JLCPCB Part Class: Extended Part; Datasheet: https://atta.szlcsc.com/upload/public/pdf/source/20160218/1457707763339.pdf; Supplier: LCSC; Tolerance: ±10%; Voltage Rated: 10V; Temperature Coefficient: X5R
C30 = CL10B223KB8NNNC: 容值:22nF;精度:±10%;额定电压:50V;材质(温度系数):X7R;; LCSC Part Name: 22nF ±10% 50V; Supplier Part: C21122; Manufacturer: SAMSUNG(三星); Supplier Footprint: 0603; JLCPCB Part Class: Basic Part; Datasheet: https://atta.szlcsc.com/upload/public/pdf/source/20160218/1457707763339.pdf; Supplier: LCSC; Tolerance: ±10%; Voltage Rated: 50V; Temperature Coefficient: X7R
C31 = CL10B474KA8NNNC: 容值:470nF;精度:±10%;额定电压:25V;材质(温度系数):X7R;; LCSC Part Name: 470nF ±10% 25V; Supplier Part: C1623; Manufacturer: SAMSUNG(三星); Supplier Footprint: 0603; JLCPCB Part Class: Basic Part; Datasheet: https://atta.szlcsc.com/upload/public/pdf/source/20160218/1457707763339.pdf; Supplier: LCSC; Tolerance: ±10%; Voltage Rated: 25V; Temperature Coefficient: X7R
H1 = PZ254R-12-16P: 插针结构:2x8P;间距:2.54mm;行距:2.54mm;圆针/方针:方针;安装类型:弯插;排数:双排;总PIN位数:16P;额定电流:-;额定电压:-;配合针长度:6mm;塑高:2.5mm;触头材质:黄铜;触头镀层:-;工作温度范围:-40℃~+105℃;颜色:黑色;; LCSC Part Name: 间距:2.54mm 2x8P 弯插 方针; Supplier Part: C492436; Manufacturer: XFCN(兴飞); Supplier Footprint: 弯插,P=2.54mm; JLCPCB Part Class: 扩展库; Datasheet: https://atta.szlcsc.com/upload/public/pdf/source/20200309/C492436_DD2BC8C297EFC04522424EFF5C609A1B.pdf; Supplier: LCSC; Pin Structure: 2x8P; Pitch: 2.54mm; Row Spacing: 2.54mm; Circluar Pins/Square Pins: 方针; Mounting Type: 弯插; Number of Rows: 双排; Number of Pins: 16P; Length of Mating Pin: 6mm; Insulation Height: 2.5mm; Contact Material: 黄铜; Operating Temperature Range: -40℃~+105℃; Color: 黑色
H2 = 2.54-2*8P母: 插孔结构:2x8P;间距:2.54mm;行距:2.54mm;安装类型:直插;排数:双排;总孔位数:16P;塑高:-;触头材质:黄铜;触头镀层:-;; LCSC Part Name: 间距:2.54mm 2x8P 直插; Supplier Part: C30734; Manufacturer: BOOMELE(博穆精密); Supplier Footprint: 插件,P=2.54mm; JLCPCB Part Class: Extended Part; Datasheet: https://atta.szlcsc.com/upload/public/pdf/source/20230817/400B44B2F3F98035DBB6B63900A9163B.pdf; Supplier: LCSC; Holes Structure: 2x8P; Pitch: 2.54mm; Row Spacing: 2.54mm; Mounting Type: 直插; Number of Rows: 双排; Number of Holes: 16P; Contact Material: 黄铜
H3 = PZ254R-12-6P: 插针结构:2x3P;间距:2.54mm;行距:2.54mm;圆针/方针:方针;安装类型:弯插;排数:双排;总PIN位数:6P;额定电流:-;额定电压:-;配合针长度:6mm;塑高:2.5mm;触头材质:黄铜;触头镀层:-;工作温度范围:-40℃~+105℃;颜色:黑色;; LCSC Part Name: 间距:2.54mm 2x3P 弯插 方针; Supplier Part: C492431; Manufacturer: XFCN(兴飞); Supplier Footprint: 弯插,P=2.54mm; JLCPCB Part Class: 扩展库; Datasheet: https://atta.szlcsc.com/upload/public/pdf/source/20200309/C492431_963045AB4FEE5C8F9F90C5FCD3C14DF0.pdf; Supplier: LCSC; Pin Structure: 2x3P; Pitch: 2.54mm; Row Spacing: 2.54mm; Circluar Pins/Square Pins: 方针; Mounting Type: 弯插; Number of Rows: 双排; Number of Pins: 6P; Length of Mating Pin: 6mm; Insulation Height: 2.5mm; Contact Material: 黄铜; Operating Temperature Range: -40℃~+105℃; Color: 黑色
H4 = DS1023-2*3SF11: 插孔结构:2x3P;间距:2.54mm;行距:2.54mm;安装类型:直插;排数:双排;总孔位数:6P;塑高:-;触头材质:-;触头镀层:-;; LCSC Part Name: 间距:2.54mm 2x3P 直插 黑色; Supplier Part: C92272; Manufacturer: CONNFLY; Supplier Footprint: 插件,P=2.54mm; JLCPCB Part Class: Extended Part; Datasheet: https://atta.szlcsc.com/upload/public/pdf/source/20200424/C92272_A95D2DA05ACA87B9C9B122019351705D.pdf; Supplier: LCSC; Holes Structure: 2x3P; Pitch: 2.54mm; Row Spacing: 2.54mm; Mounting Type: 直插; Number of Rows: 双排; Number of Holes: 6P
R23 R24 = 0603WAF6042T5E: 电阻类型:厚膜电阻;阻值:60.4kΩ;精度:±1%;功率:100mW;最大工作电压:75V;温度系数:±100ppm/℃;; LCSC Part Name: 60.4kΩ ±1% 100mW 厚膜电阻; Supplier Part: C23089; Manufacturer: UNI-ROYAL(厚声); Supplier Footprint: 0603; JLCPCB Part Class: Extended Part; Datasheet: https://atta.szlcsc.com/upload/public/pdf/source/20200306/C422600_1E6D84923E4A46A82E41ADD87F860B5C.pdf; Supplier: LCSC; Type: 厚膜电阻; Tolerance: ±1%; Power(Watts): 100mW; Overload Voltage (Max): 75V; Temperature Coefficient: ±100ppm/℃; Operating Temperature Range: -55℃~+155℃
R25 = 0603WAF4991T5E: 电阻类型:厚膜电阻;阻值:4.99kΩ;精度:±1%;功率:100mW;最大工作电压:75V;温度系数:±100ppm/℃;; LCSC Part Name: 4.99kΩ ±1% 100mW 厚膜电阻; Supplier Part: C23046; Manufacturer: UNI-ROYAL(厚声); Supplier Footprint: 0603; JLCPCB Part Class: Basic Part; Datasheet: https://atta.szlcsc.com/upload/public/pdf/source/20200306/C422600_1E6D84923E4A46A82E41ADD87F860B5C.pdf; Supplier: LCSC; Type: 厚膜电阻; Tolerance: ±1%; Power(Watts): 100mW; Overload Voltage (Max): 75V; Temperature Coefficient: ±100ppm/℃; Operating Temperature Range: -55℃~+155℃
R26 = FRC0603F3092TS: 电阻类型:厚膜电阻;阻值:30.9kΩ;精度:±1%;功率:100mW;最大工作电压:75V;温度系数:±100ppm/℃;; LCSC Part Name: 30.9kΩ ±1% 100mW 厚膜电阻; Supplier Part: C2930090; Manufacturer: FOJAN(富捷); Supplier Footprint: 0603; JLCPCB Part Class: Extended Part; Datasheet: https://atta.szlcsc.com/upload/public/pdf/source/20211221/925EC7D7225764EE0046F22065062C87.pdf; Supplier: LCSC; Type: 厚膜电阻; Tolerance: ±1%; Power(Watts): 100mW; Overload Voltage (Max): 75V; Temperature Coefficient: ±100ppm/℃; Operating Temperature Range: -55℃~+155℃
R27 = 0603WAF5102T5E: 电阻类型:厚膜电阻;阻值:51kΩ;精度:±1%;功率:100mW;最大工作电压:75V;温度系数:±100ppm/℃;; LCSC Part Name: 51kΩ ±1% 100mW 厚膜电阻; Supplier Part: C23196; Manufacturer: UNI-ROYAL(厚声); Supplier Footprint: 0603; JLCPCB Part Class: Basic Part; Datasheet: https://atta.szlcsc.com/upload/public/pdf/source/20200306/C422600_1E6D84923E4A46A82E41ADD87F860B5C.pdf; Supplier: LCSC; Type: 厚膜电阻; Tolerance: ±1%; Power(Watts): 100mW; Overload Voltage (Max): 75V; Temperature Coefficient: ±100ppm/℃; Operating Temperature Range: -55℃~+155℃
R28 = 0603WAF3902T5E: 电阻类型:厚膜电阻;阻值:39kΩ;精度:±1%;功率:100mW;最大工作电压:75V;温度系数:±100ppm/℃;; LCSC Part Name: 39kΩ ±1% 100mW 厚膜电阻; Supplier Part: C23153; Manufacturer: UNI-ROYAL(厚声); Supplier Footprint: 0603; JLCPCB Part Class: Basic Part; Datasheet: https://atta.szlcsc.com/upload/public/pdf/source/20200306/C422600_1E6D84923E4A46A82E41ADD87F860B5C.pdf; Supplier: LCSC; Type: 厚膜电阻; Tolerance: ±1%; Power(Watts): 100mW; Overload Voltage (Max): 75V; Temperature Coefficient: ±100ppm/℃; Operating Temperature Range: -55℃~+155℃
U5 = IVCC1102DR: CCM模式图腾柱模拟控制芯片; LCSC Part Name: CCM模式图腾柱模拟控制芯片 图腾柱模拟控制IC; Supplier Part: C5806827; Manufacturer: inventchip(瞻芯电子); Supplier Footprint: SOIC-16; Datasheet: https://atta.szlcsc.com/upload/public/pdf/source/20230523/D054F18E2240A011DFB2CF4947C891BB.pdf; Supplier: LCSC
U6 = USBLC6-4SC6_C5197386: Supplier Part: C5197386; Manufacturer: TECH PUBLIC(台舟); Supplier Footprint: SOT-23-6; JLCPCB Part Class: 扩展库; Datasheet: https://atta.szlcsc.com/upload/public/pdf/source/20221013/DA7C9D2E1699C4B4277AD0F5036C296E.pdf; Supplier: LCSC
C34 C39 C47 C51 C56 C64 = 0805B475K500NT: 容值:4.7uF;精度:±10%;额定电压:50V;材质(温度系数):X7R;; LCSC Part Name: 4.7uF ±10% 50V; Supplier Part: C2991173; Manufacturer: FH(风华); Supplier Footprint: 0805; JLCPCB Part Class: 扩展库; Datasheet: https://atta.szlcsc.com/upload/public/pdf/source/20200305/C486355_26A10D38EF8C2A5C37091D0039909270.pdf; Supplier: LCSC; Tolerance: ±10%; Voltage Rated: 50V; Temperature Coefficient: X7R
C36 C40-C42 C49 C53 C57-C59 C66 = CL21A106KAYNNNE_C15850: 容值:10uF;精度:±10%;额定电压:25V;材质(温度系数):X5R;; LCSC Part Name: 10uF ±10% 25V; Supplier Part: C15850; Manufacturer: SAMSUNG(三星); Manufacturer Part: CL21A106KAYNNNE; Supplier Footprint: 0805; JLCPCB Part Class: 基础库; Datasheet: https://atta.szlcsc.com/upload/public/pdf/source/20160218/1457707763339.pdf; Supplier: LCSC; Tolerance: ±10%; Voltage Rated: 25V; Temperature Coefficient: X5R
C38 C50 C55 C67 = 0603B103K500NT: 容值:10nF;精度:±10%;额定电压:50V;材质(温度系数):X7R;; LCSC Part Name: 10nF ±10% 50V; Supplier Part: C57112; Manufacturer: FH(风华); Supplier Footprint: 0603; JLCPCB Part Class: Basic Part; Datasheet: https://atta.szlcsc.com/upload/public/pdf/source/20200305/C486355_26A10D38EF8C2A5C37091D0039909270.pdf; Supplier: LCSC; Tolerance: ±10%; Voltage Rated: 50V; Temperature Coefficient: X7R
C44 C45 C61 C62 C70 = CL10A105KB8NNNC: 容值:1uF;精度:±10%;额定电压:50V;材质(温度系数):X5R;; LCSC Part Name: 1uF ±10% 50V; Supplier Part: C15849; Manufacturer: SAMSUNG(三星); Supplier Footprint: 0603; JLCPCB Part Class: Basic Part; Datasheet: https://atta.szlcsc.com/upload/public/pdf/source/20160218/1457707763339.pdf; Supplier: LCSC; Tolerance: ±10%; Voltage Rated: 50V; Temperature Coefficient: X5R
C68 = CC0603KRX7R9BB104: 容值:100nF;精度:±10%;额定电压:50V;材质(温度系数):X7R;; LCSC Part Name: 100nF ±10% 50V; Supplier Part: null; Manufacturer: YAGEO(国巨); Supplier Footprint: 0603; JLCPCB Part Class: Basic Part; Datasheet: https://atta.szlcsc.com/upload/public/pdf/source/20180910/C282072_33301C7F631E79921B82A8DAC6BCC5B3.pdf; Supplier: LCSC; Tolerance: ±10%; Voltage Rated: 50V; Temperature Coefficient: X7R
C72 = RST100UF16V003: 容值:100uF;精度:±20%;额定电压:16V;纹波电流:60mA@120Hz;等效串联电阻:-;; Supplier: LCSC; Supplier Part: C4747963; Manufacturer: KNSCHA(科尼盛); JLCPCB Part Class: 扩展库; LCSC Part Name: 100uF ±20% 16V; Supplier Footprint: SMD,D6.3xL5.4mm; Datasheet: https://atta.szlcsc.com/upload/public/pdf/source/20220722/9429C795432790648606E5D5964068FF.pdf; Tolerance: ±20%; Rated Voltage: 16V; Ripple Current: 60mA@120Hz; φD: 6.3mm; L: 5.4mm; Lifetime @ Temp: 2000hrs@105℃; Operating Temperature: -40℃~+105℃
C75 = RST47UF50V038: 容值:47uF;精度:±20%;额定电压:50V;纹波电流:63mA@120Hz;等效串联电阻:-;; LCSC Part Name: 47uF ±20% 50V; Supplier Part: C4747961; Manufacturer: KNSCHA(科尼盛); Supplier Footprint: SMD,D6.3xL7.7mm; JLCPCB Part Class: 扩展库; Datasheet: https://atta.szlcsc.com/upload/public/pdf/source/20220722/953D43C43908FD0F217BEBD17E38315C.pdf; Supplier: LCSC; Tolerance: ±20%; Rated Voltage: 50V; Ripple Current: 63mA@120Hz; φD: 6.3mm; L: 7.7mm; Lifetime @ Temp: 2000hrs@105℃; Operating Temperature: -40℃~+105℃
C76 = 0603B105K500NT: 温度系数:X7R;精度:±10%;额定电压:50V;容值:1uF;; LCSC Part Name: 1uF(105) ±10% 50V; Supplier Part: C90540; Manufacturer: FH(风华); Supplier Footprint: 0603; JLCPCB Part Class: 扩展库; Datasheet: https://atta.szlcsc.com/upload/public/pdf/source/20170923/C90540_1506149560830988967.pdf; Supplier: LCSC; Temperature Coefficient: X7R; Tolerance: ±10%; Voltage Rated: 50V
D4 D8 D11 D15 = DSK110_C908227: 二极管配置:-;正向压降(Vf):850mV@1A;直流反向耐压(Vr):100V;平均整流电流(Io):1A;; LCSC Part Name: 电压:100V 电流:1A; Supplier Part: C908227; Manufacturer: FUXINSEMI(富芯森美); Manufacturer Part: DSK110; Supplier Footprint: SOD-123; JLCPCB Part Class: 扩展库; Datasheet: https://atta.szlcsc.com/upload/public/pdf/source/20201027/C908227_56774C7FA3F54032F9E299E0F5E1A587.pdf; Supplier: LCSC; Forward Voltage (Vf@If): 850mV@1A; Reverse Voltage (Vr): 100V; Average Rectified Current (Io): 1A; Reverse Leakage Current (Ir): 500nA
D24 D25 = 1SMA4735A: 二极管配置:独立式;稳压值(标称值):6.2V;稳压值(范围):5.86V~6.51V;功率:1W;精度:±5%;; Supplier Part: C438356; Manufacturer: 晶导微电子; Supplier Footprint: SMA; Datasheet: https://atta.szlcsc.com/upload/public/pdf/source/20191016/C438379_D516EA6EC0252B18A685B1726D67BD37.pdf; Supplier: LCSC; Diode Configuration: 独立式; Zener Voltage (Nom): 6.2V; Reverse Leakage Current (Ir): 10uA@3V; Zener Voltage (Range): 5.86V~6.51V; Power Dissipation: 1W; Zener Impedance (Zzt): 2Ω; Tolerance: ±5%
L5 = MWSA0402S-100MT: 类型:-;电感值:10uH;精度:±20%;额定电流:1.6A;饱和电流(Isat):2A;; LCSC Part Name: 10uH ±20% 2A; Supplier Part: C408339; Manufacturer: Sunlord(顺络); Supplier Footprint: SMD; JLCPCB Part Class: Extended Part; Datasheet: https://atta.szlcsc.com/upload/public/pdf/source/20190729/C408339_3BC98729F1BEEFAE5AEBBEB66576AB79.pdf; Supplier: LCSC; Tolerance: ±20%; Rated Current: 1.6A; Saturation Current (Isat): 2A; DC Resistance (DCR): 282mΩ
R32 R41 = 1206W4F100KT5E: 电阻类型:厚膜电阻;阻值:1Ω;精度:±1%;功率:250mW;最大工作电压:200V;温度系数:±800ppm/℃;; LCSC Part Name: 1Ω ±1% 250mW 厚膜电阻; Supplier Part: C17928; Manufacturer: UNI-ROYAL(厚声); Supplier Footprint: 1206; JLCPCB Part Class: Basic Part; Datasheet: https://atta.szlcsc.com/upload/public/pdf/source/20200306/C422600_1E6D84923E4A46A82E41ADD87F860B5C.pdf; Supplier: LCSC; Type: 厚膜电阻; Tolerance: ±1%; Power(Watts): 250mW; Overload Voltage (Max): 200V; Temperature Coefficient: ±800ppm/℃; Operating Temperature Range: -55℃~+155℃
R48 = 0603WAF4701T5E: 电阻类型:厚膜电阻;阻值:4.7kΩ;精度:±1%;功率:100mW;最大工作电压:75V;温度系数:±100ppm/℃;; LCSC Part Name: 4.7kΩ ±1% 100mW 厚膜电阻; Supplier Part: C23162; Manufacturer: UNI-ROYAL(厚声); Supplier Footprint: 0603; JLCPCB Part Class: Basic Part; Datasheet: https://atta.szlcsc.com/upload/public/pdf/source/20200306/C422600_1E6D84923E4A46A82E41ADD87F860B5C.pdf; Supplier: LCSC; Type: 厚膜电阻; Tolerance: ±1%; Power(Watts): 100mW; Overload Voltage (Max): 75V; Temperature Coefficient: ±100ppm/℃; Operating Temperature Range: -55℃~+155℃
R50 = 0603WAF1201T5E: 电阻类型:厚膜电阻;阻值:1.2kΩ;精度:±1%;功率:100mW;最大工作电压:75V;温度系数:±100ppm/℃;; LCSC Part Name: 1.2kΩ ±1% 100mW 厚膜电阻; Supplier Part: C22765; Manufacturer: UNI-ROYAL(厚声); Supplier Footprint: 0603; JLCPCB Part Class: Basic Part; Datasheet: https://atta.szlcsc.com/upload/public/pdf/source/20200306/C422600_1E6D84923E4A46A82E41ADD87F860B5C.pdf; Supplier: LCSC; Type: 厚膜电阻; Tolerance: ±1%; Power(Watts): 100mW; Overload Voltage (Max): 75V; Temperature Coefficient: ±100ppm/℃; Operating Temperature Range: -55℃~+155℃
R105-R108 = Res_0805: Supplier Footprint: 0805
T1 T2 = TR1495_2xilie: MOS驱动脉冲变压器; Check: false
U8 U11 = VPS8703B: 专业电源管理（PMIC）@@全桥拓扑结构 可选择开环 LLC 驱动模式、高集成度，外围简单、输入冲击电压高达 38V、频率同步功能、; Supplier Part: C7470608; Manufacturer: VPSC(源特科技); Supplier Footprint: ESOP8; JLCPCB Part Class: 扩展库; Datasheet: https://atta.szlcsc.com/upload/public/pdf/source/20230726/390340B6E07FCAB75DDFFFFED85A5858.pdf; Supplier: LCSC
U13 = MT2492: 功能类型:降压型;同步整流:-;输出通道数:-;拓扑结构:-;输入电压:-;输出电流(最大值):-;开关频率:-;; LCSC Part Name: 降压型; Supplier Part: C89358; Manufacturer: 西安航天民芯; Supplier Footprint: SOT-23-6; JLCPCB Part Class: 扩展库; Datasheet: https://atta.szlcsc.com/upload/public/pdf/source/20221209/5C81DA9662873D3A116170FFBF63E49D.pdf; Supplier: LCSC; Function: 降压型
U14 = 12V辅源: Check: false

## Nets
+5V: C69.2 C72.1 C73.2 H2.11 L5.2 R48.1 R49.2 ; also on sheet 4 6
+5V1: C22.2 C23.1 C32.2 C33.1 H1.12 U5.12(VCC) U6.5 ; also on sheet 5
+12V: C45.2 C46.2 C62.2 C63.2 C70.1 C71.2 C74.2 C75.1 C76.2 D1.2(K) K1.2 R19.2 R47.2 U8.3(VIN) U11.3(VIN) U13.5(IN) U14.3(+) ; also on sheet 6
GND: C19.1 C20.2 C21.2 C22.1 C23.2 C24.1 C25.1 C26.1 C27.1 C28.1 C29.1 C30.1 C31.1 C32.1 C33.2 C45.1 C46.1 C62.1 C63.1 C69.1 C70.2 C71.1 C72.2 C73.1 C74.1 C75.2 C76.1 D2.1 H1.9 H2.10 H3.3 H4.4 L1.1 LED2.1(C) Q3.2(S) R1.2 R4.2 R5.2 R18.1 R26.1 R27.1 R28.1 R50.1 R109.2 U5.1(GND) U6.2 U8.2(GND) U8.9(EP) U11.2(GND) U11.9(EP) U13.2(GND) U14.4(-) ; also on sheet 4 5 6
PGND: C9.2 C10.2 C11.2 C12.1 C13.1 C14.1 C15.2 C16.2 C17.1 C18.1 C64.1 C65.1 C66.1 C67.1 D15.1(A) D16.1(A) Q4.2(S) R45.1 U2.2(A) U4.2 ; also on sheet 4 6
AC_CSP: C24.2 R23.2 U5.4(CAO) ; also on sheet 5
ACL: C2.1 C5.2 L3.3 R3.1 R4.1 R5.1 R7.1 R109.1 U2.1(K) U3.2(A) U14.2(AC)
CSN: H1.5 R22.2
CSN1: H2.6 R1.1
CSP: H1.6 R21.2
CSP1: H2.5 R3.2
FAN_SEEPD: H3.5 ; also on sheet 5
FAN_SEEPD1: H4.6 ; also on sheet 6
GDH: H1.13 U5.14(GDH) U6.3
GDH1: H2.14 ; also on sheet 4
GDL: H1.16 U5.13(GDL) U6.4
GDL1: H2.15 ; also on sheet 4
H+13V: C47.2 C48.2 C49.2 C50.2 D6.2(K) D7.2(K) R36.2 ; also on sheet 4
H+18V: C34.2 C35.2 C36.2 C37.2 C38.2 D3.2(K) R31.2 R105.2 R107.2 ; also on sheet 4
H-6V: C35.1 C38.1 C39.1 C40.1 C41.1 C42.1 C43.1 D4.1(A) D24.2(A) R31.1 ; also on sheet 4
HDGND: C53.1 C54.1 C57.2 C58.2 C59.2 C60.2 D25.1(C) Q4.3(DS) R106.1 R108.1 ; also on sheet 4
HFDN: Q4.4(G) ; also on sheet 4
HFUP: Q1.4(G) ; also on sheet 4
HGND: C5.1 C47.1 C48.1 C49.1 C50.1 D8.1(A) D9.1(A) L4.2 R8.1 R36.1 U14.1(AC) ; also on sheet 4
HUGND: C36.1 C37.1 C40.2 C41.2 C42.2 C43.2 D24.1(C) Q1.3(DS) R105.1 R107.1 ; also on sheet 4
HV: C8.2 C15.1 C16.1 C17.2 C18.2 K1.5 Q1.1(D) R16.1 U3.1(K)
HVBUS: C8.1 C9.1 C10.1 C11.1 C12.2 C13.2 C14.2 K1.3 K1.4 R17.2 U4.1 ; also on sheet 6
L+13V: C64.2 C65.2 C66.2 C67.2 D13.2(K) D14.2(K) R45.2 ; also on sheet 4
L+18V: C51.2 C52.2 C53.2 C54.2 C55.2 D10.2(K) R40.2 R106.2 R108.2 ; also on sheet 4
L-6V: C52.1 C55.1 C56.1 C57.1 C58.1 C59.1 C60.1 D11.1(A) D25.2(A) R40.1 ; also on sheet 4
NTC: H3.4 ; also on sheet 5
NTC1: H4.3 ; also on sheet 6
P+5V: D2.2 ; also on sheet 6
PE: C1.2 C2.2 C6.1 C7.2 U1.1
POWER_EN: H3.2 ; also on sheet 5
POWER_EN1: H4.1 U8.4(EN) U11.4(EN)
PWM: H3.1 ; also on sheet 5
PWM1: H4.2 ; also on sheet 6
RELY: H1.7 R28.2 U5.9(RELAY)
RELY1: D2.3 H2.8 R20.1
SFH: H1.14 U5.15(SFH) U6.1
SFH1: H2.13 ; also on sheet 4
SFL: H1.11 U5.16(SFL) U6.6
SFL1: H2.12 ; also on sheet 4
VACN: C25.2 H1.1 U5.6(VACN)
VACN1: H2.2 R14.2
VACP: C26.2 H1.2 U5.5(VACP)
VACP1: H2.1 R10.2
VDC_SEN: H1.10 R25.2 ; also on sheet 5
VDC_SEN1: H2.9 ; also on sheet 6
VS: L1.2 Q1.2(S) Q4.1(D)
$1N516: R7.2 R9.1
$1N518: R8.2 R11.1
$1N568: R9.2 R12.1
$1N570: R11.2 R13.1
$1N620: R10.1 R12.2
$1N622: R13.2 R14.1
$1N1611: R16.2 R17.1
$1N1877: C19.2 Q3.1(G) R18.2 R20.2
$1N3032: R2.1 R6.2
$1N3034: R6.1 R15.2
$1N4085: C3.2 F1.1 U1.2
$1N9118: C7.1 L3.4 L4.1
$1N9130: C4.1 C6.2 L2.4 L3.1
$1N9142: C3.1 L2.1 R15.1 U1.3
$1N9157: F1.2 L2.2 R2.2
$1N9163: C1.1 C4.2 L2.3 L3.2
$1N9298: D1.1(A) K1.1 LED1.1(C) Q3.3(D)
$1N11666: LED1.2(A) R19.1
$2N465: C28.2 R25.1 U5.11(VSNS)
$2N594: C30.2 R24.2 U5.10(VAO)
$2N650: C31.2 R24.1
$2N738: C29.2 R27.2 U5.8(VRMS)
$2N776: R26.2 U5.7(RT)
$2N849: C20.1 R21.1 U5.2(CSP)
$2N951: C21.1 R22.1 U5.3(CSN)
$2N1205: C27.2 R23.1
$3N370: R32.2 T1.1(8)
$3N374: R32.1 U8.8(VD1)
$3N400: C44.2 T1.6(1)
$3N441: C44.1 U8.5(VD2)
$3N877: R47.1 U13.4(EN)
$3N879: C68.2 L5.1 U13.6(SW)
$3N880: C68.1 U13.1(BS)
$3N2105: D6.1(A) D8.2(K) T1.3(6)
$3N2111: D7.1(A) D9.2(K) T1.4(3)
$3N2898: D3.1(A) D4.2(K) T1.2(5)
$3N3048: C34.1 C39.2 T1.5(4)
$3N8419: R41.2 T2.1(8)
$3N8422: R41.1 U11.8(VD1)
$3N8425: C61.2 T2.6(1)
$3N8427: C61.1 U11.5(VD2)
$3N8432: D13.1(A) D15.2(K) T2.3(6)
$3N8437: D14.1(A) D16.2(K) T2.4(3)
$3N8459: D10.1(A) D11.2(K) T2.2(5)
$3N8465: C51.1 C56.2 T2.5(4)
$3N31007: LED2.2(A) R48.2
$3N35943: R49.1 R50.2 U13.3(FB)

Not connected (* = marked no-connect by the designer): H1 3* 4* 8* 15; H2 3* 4* 7* 16*; H3 6*; H4 5*; Q2 1(G) 2(D) 3(S); Q5 1(G) 2(D) 3(S); U8 1(CLK)* 6(NC)* 7(NC)*; U11 1(CLK)* 6(NC)* 7(NC)*

## Notes on the sheets
sheet 1
- 快桥臂
- 所有的GND基于ACL 经过 采样电阻的电位
- 慢桥臂
- NC
sheet 2
- NC
- NC
sheet 3
- 匝比20：20:20
- 匝比20：20:20
